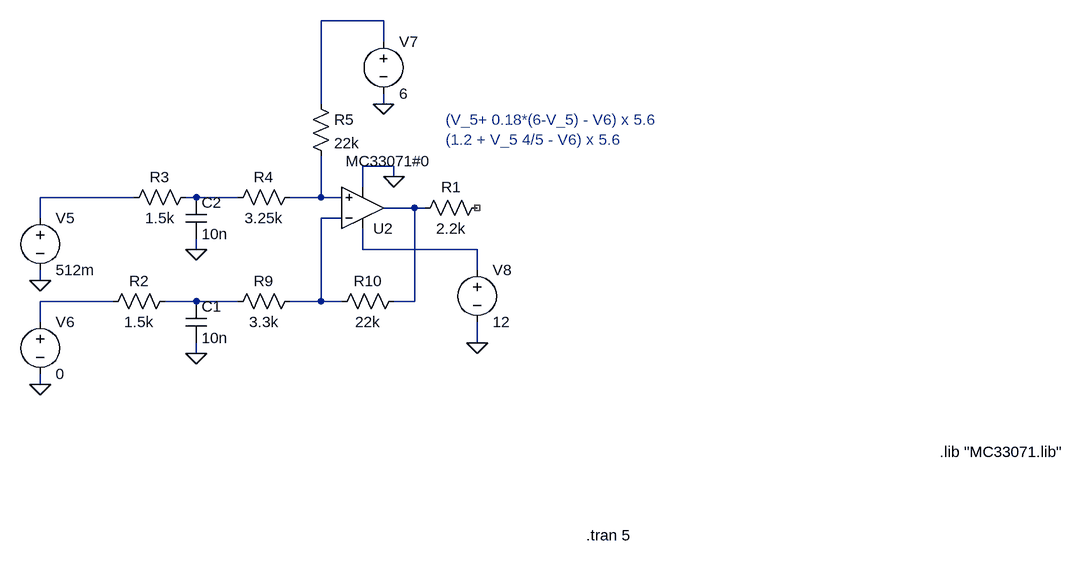
[diagram p0: schematic test.asc]
test.asc, the LTspice schematic file:
Version 4
SHEET 1 880 680
WIRE -288 -272 -384 -272
WIRE -288 -240 -288 -272
WIRE -384 -144 -384 -272
WIRE -288 -144 -288 -160
WIRE -272 -48 -320 -48
WIRE -272 -32 -272 -48
WIRE -320 -16 -320 -48
WIRE -672 0 -816 0
WIRE -576 0 -592 0
WIRE -512 0 -576 0
WIRE -384 0 -384 -64
WIRE -384 0 -432 0
WIRE -352 0 -384 0
WIRE -240 16 -288 16
WIRE -224 16 -240 16
WIRE -816 32 -816 0
WIRE -352 32 -384 32
WIRE -576 80 -576 64
WIRE -320 80 -320 48
WIRE -144 80 -320 80
WIRE -144 112 -144 80
WIRE -816 128 -816 112
WIRE -704 160 -816 160
WIRE -576 160 -624 160
WIRE -512 160 -576 160
WIRE -384 160 -384 32
WIRE -384 160 -432 160
WIRE -352 160 -384 160
WIRE -240 160 -240 16
WIRE -240 160 -272 160
WIRE -816 192 -816 160
WIRE -144 224 -144 192
WIRE -576 240 -576 224
WIRE -816 288 -816 272
FLAG -272 -32 0
FLAG -816 128 0
FLAG -816 288 0
FLAG -288 -144 0
FLAG -144 224 0
FLAG -576 240 0
FLAG -576 80 0
SYMBOL res -416 144 R90
WINDOW 0 0 56 VBottom 2
WINDOW 3 32 56 VTop 2
SYMATTR InstName R9
SYMATTR Value 3.3k
SYMBOL res -256 144 R90
WINDOW 0 0 56 VBottom 2
WINDOW 3 32 56 VTop 2
SYMATTR InstName R10
SYMATTR Value 22k
SYMBOL OpAmps\\opamp2 -320 80 M180
WINDOW 3 -26 136 Left 2
SYMATTR InstName U2
SYMATTR Value MC33071#0
SYMBOL voltage -816 16 R0
WINDOW 123 0 0 Left 0
WINDOW 39 0 0 Left 0
SYMATTR InstName V5
SYMATTR Value 512m
SYMBOL voltage -816 176 R0
SYMATTR InstName V6
SYMATTR Value 0
SYMBOL voltage -288 -256 R0
WINDOW 123 0 0 Left 0
WINDOW 39 0 0 Left 0
SYMATTR InstName V7
SYMATTR Value 6
SYMBOL voltage -144 96 R0
SYMATTR InstName V8
SYMATTR Value 12
SYMBOL res -128 0 R90
WINDOW 0 0 56 VBottom 2
WINDOW 3 32 56 VTop 2
SYMATTR InstName R1
SYMATTR Value 2.2k
SYMBOL cap -592 160 R0
SYMATTR InstName C1
SYMATTR Value 10n
SYMBOL res -608 144 R90
WINDOW 0 0 56 VBottom 2
WINDOW 3 32 56 VTop 2
SYMATTR InstName R2
SYMATTR Value 1.5k
SYMBOL res -576 -16 R90
WINDOW 0 0 56 VBottom 2
WINDOW 3 32 56 VTop 2
SYMATTR InstName R3
SYMATTR Value 1.5k
SYMBOL res -416 -16 R90
WINDOW 0 0 56 VBottom 2
WINDOW 3 32 56 VTop 2
SYMATTR InstName R4
SYMATTR Value 3.25k
SYMBOL cap -592 0 R0
SYMATTR InstName C2
SYMATTR Value 10n
SYMBOL res -400 -160 R0
SYMATTR InstName R5
SYMATTR Value 22k
TEXT 24 520 Left 2 !.tran 5
TEXT 568 392 Left 2 !.lib "MC33071.lib"
TEXT -192 -120 Left 2 ;(V_5+ 0.18*(6-V_5) - V6) x 5.6\n(1.2 + V_5 4/5 - V6) x 5.6

The netlist it stands for:
* test.asc
R9 N006 N009 3.3k
R10 N005 N006 22k
XU2 N004 N006 N007 0 N005 MC33071#0  ; pins In+ In- V+ V- OUT
V5 N002 0 512m
V6 N008 0 0
V7 N001 0 6
V8 N007 0 12
R1 NC_01 N005 2.2k
C1 N009 0 10n
R2 N009 N008 1.5k
R3 N003 N002 1.5k
R4 N004 N003 3.25k
C2 N003 0 10n
R5 N001 N004 22k
.tran 5
.lib "MC33071.lib"
* (V_5+ 0.18*(6-V_5) - V6) x 5.6
* (1.2 + V_5 4/5 - V6) x 5.6
.backanno
.end